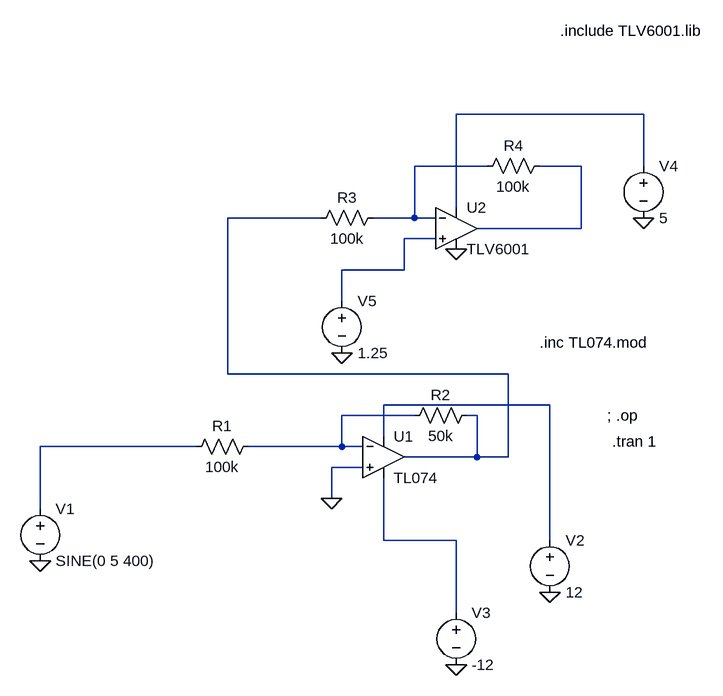
[diagram p0: schematic freezer_opamps.asc]
freezer_opamps.asc, the LTspice schematic file:
Version 4
SHEET 1 1132 680
WIRE 768 -928 480 -928
WIRE 528 -848 416 -848
WIRE 672 -848 608 -848
WIRE 768 -848 768 -928
WIRE 480 -784 480 -928
WIRE 272 -768 128 -768
WIRE 416 -768 416 -848
WIRE 416 -768 352 -768
WIRE 448 -768 416 -768
WIRE 672 -752 672 -848
WIRE 672 -752 512 -752
WIRE 448 -736 400 -736
WIRE 400 -688 400 -736
WIRE 400 -688 304 -688
WIRE 304 -640 304 -688
WIRE 128 -528 128 -768
WIRE 560 -528 128 -528
WIRE 624 -480 368 -480
WIRE 416 -464 304 -464
WIRE 512 -464 496 -464
WIRE 368 -432 368 -480
WIRE 80 -416 -160 -416
WIRE 304 -416 304 -464
WIRE 304 -416 160 -416
WIRE 336 -416 304 -416
WIRE 512 -400 512 -464
WIRE 512 -400 400 -400
WIRE 560 -400 560 -528
WIRE 560 -400 512 -400
WIRE 336 -384 288 -384
WIRE 288 -336 288 -384
WIRE -160 -320 -160 -416
WIRE 368 -272 368 -368
WIRE 480 -272 368 -272
WIRE 624 -272 624 -480
WIRE 480 -160 480 -272
FLAG -160 -240 0
FLAG 624 -192 0
FLAG 288 -336 0
FLAG 480 -720 0
FLAG 480 -80 0
FLAG 768 -768 0
FLAG 304 -560 0
SYMBOL voltage -160 -336 R0
WINDOW 123 0 0 Left 0
WINDOW 39 0 0 Left 0
SYMATTR InstName V1
SYMATTR Value SINE(0 5 400)
SYMBOL voltage 624 -288 R0
WINDOW 123 0 0 Left 0
WINDOW 39 0 0 Left 0
SYMATTR InstName V2
SYMATTR Value 12
SYMBOL Opamps\\opamp2 368 -464 R0
SYMATTR InstName U1
SYMATTR Value TL074
SYMBOL res 176 -432 R90
WINDOW 0 0 56 VBottom 2
WINDOW 3 32 56 VTop 2
SYMATTR InstName R1
SYMATTR Value 100k
SYMBOL res 512 -480 R90
WINDOW 0 0 56 VBottom 2
WINDOW 3 32 56 VTop 2
SYMATTR InstName R2
SYMATTR Value 50k
SYMBOL voltage 480 -176 R0
WINDOW 123 0 0 Left 0
WINDOW 39 0 0 Left 0
SYMATTR InstName V3
SYMATTR Value -12
SYMBOL voltage 768 -864 R0
WINDOW 123 0 0 Left 0
WINDOW 39 0 0 Left 0
SYMATTR InstName V4
SYMATTR Value 5
SYMBOL res 368 -784 R90
WINDOW 0 0 56 VBottom 2
WINDOW 3 32 56 VTop 2
SYMATTR InstName R3
SYMATTR Value 100k
SYMBOL res 624 -864 R90
WINDOW 0 0 56 VBottom 2
WINDOW 3 32 56 VTop 2
SYMATTR InstName R4
SYMATTR Value 100k
SYMBOL voltage 304 -656 R0
WINDOW 123 0 0 Left 0
WINDOW 39 0 0 Left 0
SYMATTR InstName V5
SYMATTR Value 1.25
SYMBOL Opamps\\opamp2 480 -816 R0
SYMATTR InstName U2
SYMATTR Value TLV6001
TEXT 712 -464 Left 2 !; .op
TEXT 720 -424 Left 2 !.tran 1
TEXT 608 -576 Left 2 !.inc TL074.mod
TEXT 640 -1056 Left 2 !.include TLV6001.lib

The netlist it stands for:
* freezer_opamps.asc
V1 N008 0 SINE(0 5 400)
V2 N006 0 12
XU1 0 N007 N006 N009 N004 TL074  ; pins In+ In- V+ V- OUT
R1 N007 N008 100k
R2 N004 N007 50k
V3 N009 0 -12
V4 N001 0 5
R3 N002 N004 100k
R4 N003 N002 100k
V5 N005 0 1.25
XU2 N005 N002 N001 0 N003 TLV6001  ; pins In+ In- V+ V- OUT
; .op
.tran 1
.inc TL074.mod
.include TLV6001.lib
.backanno
.end